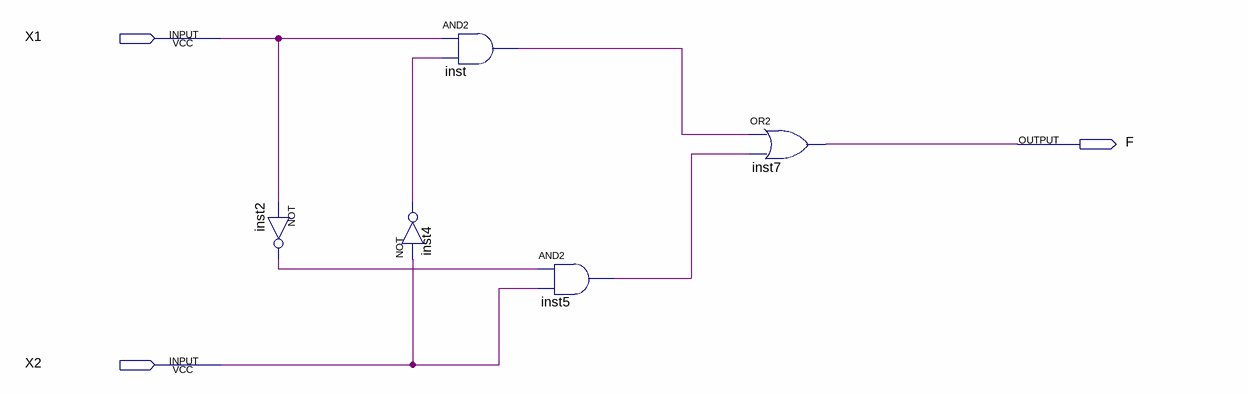
[diagram p0: schematic sheet]
// Quartus schematic light.bdf as structural Verilog: 5 symbols, 3 pins
module light (
  input  X1,
  input  X2,
  output F
);

  wire inst2_out, inst4_out, inst5_out, inst_out;

  not inst2 (inst2_out, X1);
  not inst4 (inst4_out, X2);
  and inst (inst_out, X1, inst4_out);
  and inst5 (inst5_out, inst2_out, X2);
  or inst7 (F, inst_out, inst5_out);
endmodule
